# EAGLE design v2UvSterilisator (EAGLE 7.7.0)
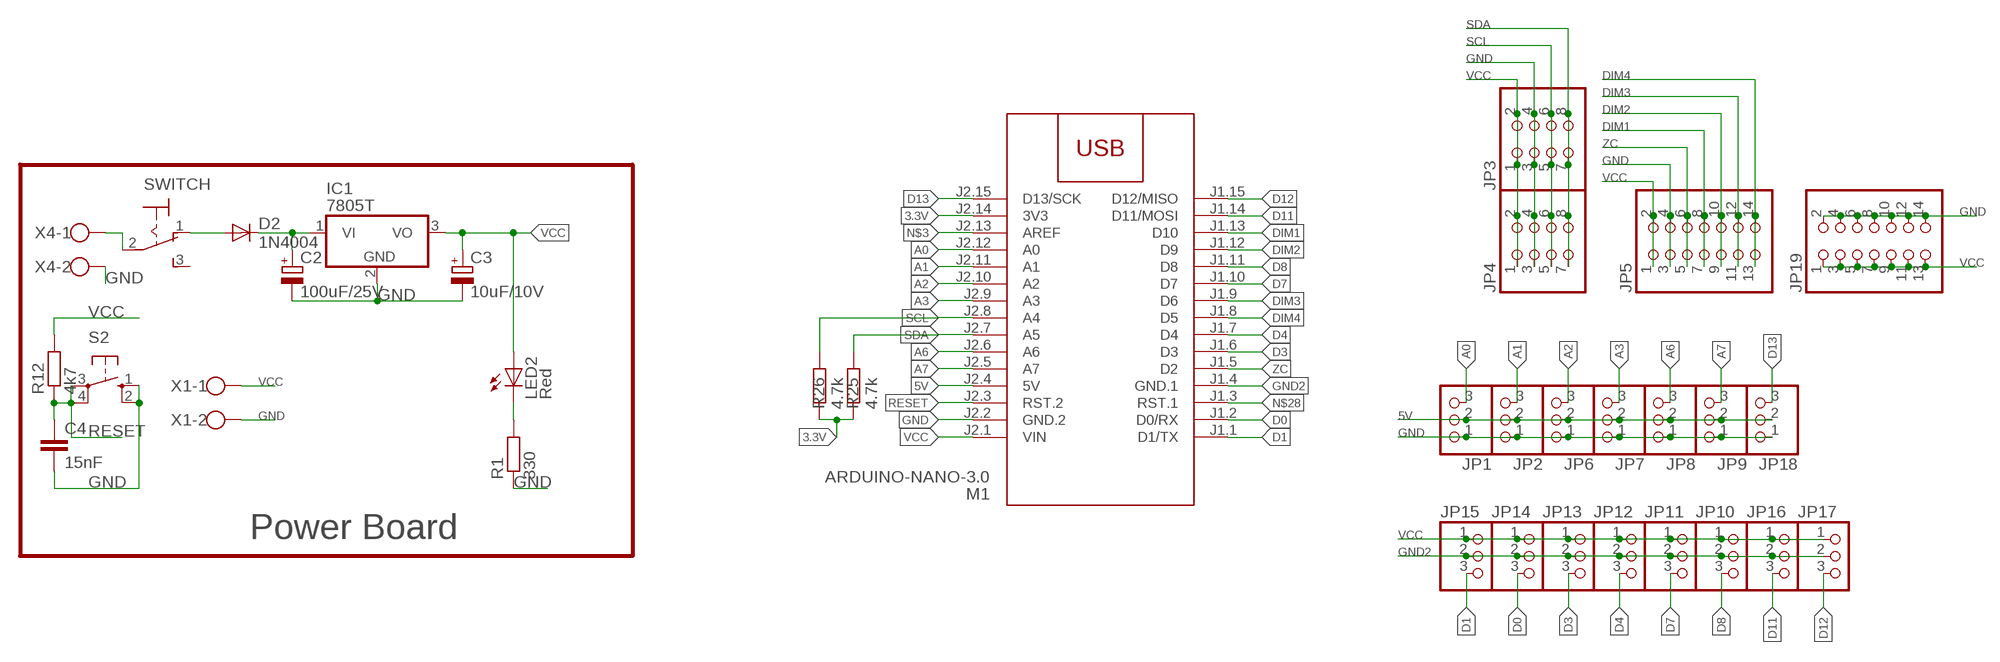
[diagram p0: schematic, sheet 1]

## Parts
C2  100uF/25V  CPOL-EUE5-8.5  [E5-8,5]
C3  10uF/10V  CPOL-EUE5-8.5  [E5-8,5]
C4  15nF  C-EUC0805  [C0805]
D2  1N4004  [DO41-10]
IC1  7805T  [TO220H]
JP1  PINHD-1X3  [1X03]
JP2  PINHD-1X3  [1X03]
JP3  PINHD-2X4  [2X04]
JP4  PINHD-2X4  [2X04]
JP5  PINHD-2X7  [2X07]
JP6  PINHD-1X3  [1X03]
JP7  PINHD-1X3  [1X03]
JP8  PINHD-1X3  [1X03]
JP9  PINHD-1X3  [1X03]
JP10  PINHD-1X3  [1X03]
JP11  PINHD-1X3  [1X03]
JP12  PINHD-1X3  [1X03]
JP13  PINHD-1X3  [1X03]
JP14  PINHD-1X3  [1X03]
JP15  PINHD-1X3  [1X03]
JP16  PINHD-1X3  [1X03]
JP17  PINHD-1X3  [1X03]
JP18  PINHD-1X3  [1X03]
JP19  PINHD-2X7  [2X07]
LED2  Red  LED3MM  [LED3MM]
M1  ARDUINO-NANO-3.0  [ARDUINO-NANO-3.0]
R1  330  R-EU_R1206  [R1206]
R12  4k7  R-EU_R1206  [R1206]
R25  4.7k  R-EU_R1206  [R1206]
R26  4.7k  R-EU_R1206  [R1206]
S2  10-XX  [B3F-10XX]
SWITCH  M9040P  [M9040P]
X1  W237-102  [W237-102]
X4  W237-102  [W237-102]

## Nets
3.3V: M1.J2.14(3V3) R25.2 R26.2
5V: JP1.2 JP2.2 JP6.2 JP7.2 JP8.2 JP9.2 JP18.2 M1.J2.4(5V)
12VSWITCH: D2.A SWITCH.1(O)
A0: JP1.3 M1.J2.12(A0)
A1: JP2.3 M1.J2.11(A1)
A2: JP6.3 M1.J2.10(A2)
A3: JP7.3 M1.J2.9(A3)
A6: JP8.3 M1.J2.6(A6)
A7: JP9.3 M1.J2.5(A7)
D0: JP14.3 M1.J1.2(D0/RX)
D1: JP15.3 M1.J1.1(D1/TX)
D3: JP13.3 M1.J1.6(D3)
D4: JP12.3 M1.J1.7(D4)
D7: JP11.3 M1.J1.10(D7)
D8: JP10.3 M1.J1.11(D8)
D11: JP16.3 M1.J1.14(D11/MOSI)
D12: JP17.3 M1.J1.15(D12/MISO)
D13: JP18.3 M1.J2.15(D13/SCK)
DIM1: JP5.7 JP5.8 M1.J1.13(D10)
DIM2: JP5.9 JP5.10 M1.J1.12(D9)
DIM3: JP5.11 JP5.12 M1.J1.9(D6)
DIM4: JP5.13 JP5.14 M1.J1.8(D5)
GND: C2.- C3.- C4.2 IC1.2(GND) JP1.1 JP2.1 JP3.3 JP3.4 JP4.3 JP4.4 JP5.3 JP5.4 JP6.1 JP7.1 JP8.1 JP9.1 JP18.1 JP19.2 JP19.4 JP19.6 JP19.8 JP19.10 JP19.12 JP19.14 M1.J2.2(GND.2) R1.1 S2.1(S) S2.2(S1) X1.2 X4.2
GND2: JP10.2 JP11.2 JP12.2 JP13.2 JP14.2 JP15.2 JP16.2 JP17.2 M1.J1.4(GND.1)
N$3: M1.J2.13(AREF)
N$28: M1.J1.3(RST.1)
N$37: C2.+ D2.C IC1.1(VI)
N$39: LED2.K(C) R1.2
N$40: SWITCH.2(P) X4.1
RESET: C4.1 M1.J2.3(RST.2) R12.1 S2.3(P) S2.4(P1)
SCL: JP3.5 JP3.6 JP4.5 JP4.6 M1.J2.8(A4) R26.1
SDA: JP3.7 JP3.8 JP4.7 JP4.8 M1.J2.7(A5) R25.1
VCC: C3.+ IC1.3(VO) JP3.1 JP3.2 JP4.1 JP4.2 JP5.1 JP5.2 JP10.1 JP11.1 JP12.1 JP13.1 JP14.1 JP15.1 JP16.1 JP17.1 JP19.1 JP19.3 JP19.5 JP19.7 JP19.9 JP19.11 JP19.13 LED2.A M1.J2.1(VIN) R12.2 X1.1
ZC: JP5.5 JP5.6 M1.J1.5(D2)
Unconnected: SWITCH.3(S)

## Notes on the sheet
- Power Board

## Library data of the parts
C2 C3 = rcl:CPOL-EU: POLARIZED CAPACITOR, European symbol
C4 = rcl:C-EU: CAPACITOR, European symbol
D2 = diode:1N4004: DIODE general purpose rectifier, 1 A
IC1 = linear:78*: Positive VOLTAGE REGULATOR Source: http://cache.national.com/ds/LM/LM78L05.pdf http://www.fairchildsemi.com/ds/LM/LM7805.pdf
JP1 JP2 JP6-JP18 = adafruit:PINHD-1X3: PIN HEADER
JP3 JP4 = adafruit:PINHD-2X4: PIN HEADER
JP5 JP19 = pinhead:PINHD-2X7: PIN HEADER
LED2 = led:LED: LED OSRAM: - CHIPLED LG R971, LG N971, LY N971, LG Q971, LY Q971, LO R971, LY R971 LH N974, LH R974 LS Q976, LO Q976, LY Q976 LO Q996 - Hyper CHIPLED LW Q18S LB Q993, LB Q99A, LB R99A - SideLED LS A670, LO A670, LY A670, LG A670, LP A670 LB A673, LV A673, LT A673, LW A673 LH A674 LY A675 LS A676, LA A676, LO A676, LY A676, LW A676 LS A679, LY A679, LG A679 - Hyper Micro SIDELED® LS Y876, LA Y876, LO Y876, LY Y876 LT Y87S - SmartLED LW L88C, LW L88S LB L89C, LB L89S, LG L890 LS L89K, LO L89K, LY L89K LS L896, LA L896, LO L896, LY L896 - TOPLED LS T670, LO T670, LY T670, LG T670, LP T670 LSG T670, LSP T670, LSY T670, LOP T670, LYG T670 LG T671, LOG T671, LSG T671 LB T673, LV T673, LT T673, LW T673 LH T674 LS T676, LA T676, LO T676, LY T676, LB T676, LH T676, LSB T676, LW T676 LB T67C, LV T67C, LT T67C, LS T67K, LO T67K, LY T67K, LW E67C LS E67B, LA E67B, LO E67B, LY E67B, LB E67C, LV E67C, LT E67C LW T67C LS T679, LY T679, LG T679 LS T770, LO T770, LY T770, LG T770, LP T770 LB T773, LV T773, LT T773, LW T773 LH T774 LS E675, LA E675, LY E675, LS T675 LS T776, LA T776, LO T776, LY T776, LB T776 LHGB T686 LT T68C, LB T68C - Hyper Mini TOPLED® LB M676 - Mini TOPLED Santana® LG M470 LS M47K, LO M47K, LY M47K Source: http://www.osram.convergy.de LUXEON: - LUMILED® LXK2-PW12-R00, LXK2-PW12-S00, LXK2-PW14-U00, LXK2-PW14-V00 LXK2-PM12-R00, LXK2-PM12-S00, LXK2-PM14-U00 LXK2-PE12-Q00, LXK2-PE12-R00, LXK2-PE12-S00, LXK2-PE14-T00, LXK2-PE14-U00 LXK2-PB12-K00, LXK2-PB12-L00, LXK2-PB12-M00, LXK2-PB14-N00, LXK2-PB14-P00, LXK2-PB14-Q00 LXK2-PR12-L00, LXK2-PR12-M00, LXK2-PR14-Q00, LXK2-PR14-R00 LXK2-PD12-Q00, LXK2-PD12-R00, LXK2-PD12-S00 LXK2-PH12-R00, LXK2-PH12-S00 LXK2-PL12-P00, LXK2-PL12-Q00, LXK2-PL12-R00 Source: www.luxeon.com KINGBRIGHT: KA-3528ASYC Source: www.kingbright.com
M1 = diy-modules:ARDUINO-NANO-3.0: Arduino Nano 3.0 and compatible devices More details available here: https://www.arduino.cc/en/Main/ArduinoBoardNano Click here to find device on ebay.com <http://www.ebay.com/sch/arduino+nano>
R1 R12 R25 R26 = rcl:R-EU_: RESISTOR, European symbol
S2 = switch-omron:10-XX: OMRON SWITCH; MPN: B3F-1000; OC_FARNELL: 176432; OC_NEWARK: 36M3542
SWITCH = switch:M9040P: TOGGLE SWITCH Marquardt
X1 X4 = wago102:W237-102: WAGO SCREW CLAMP; MPN: 237-102; OC_FARNELL: unknown; OC_NEWARK: 70K9898

## Board
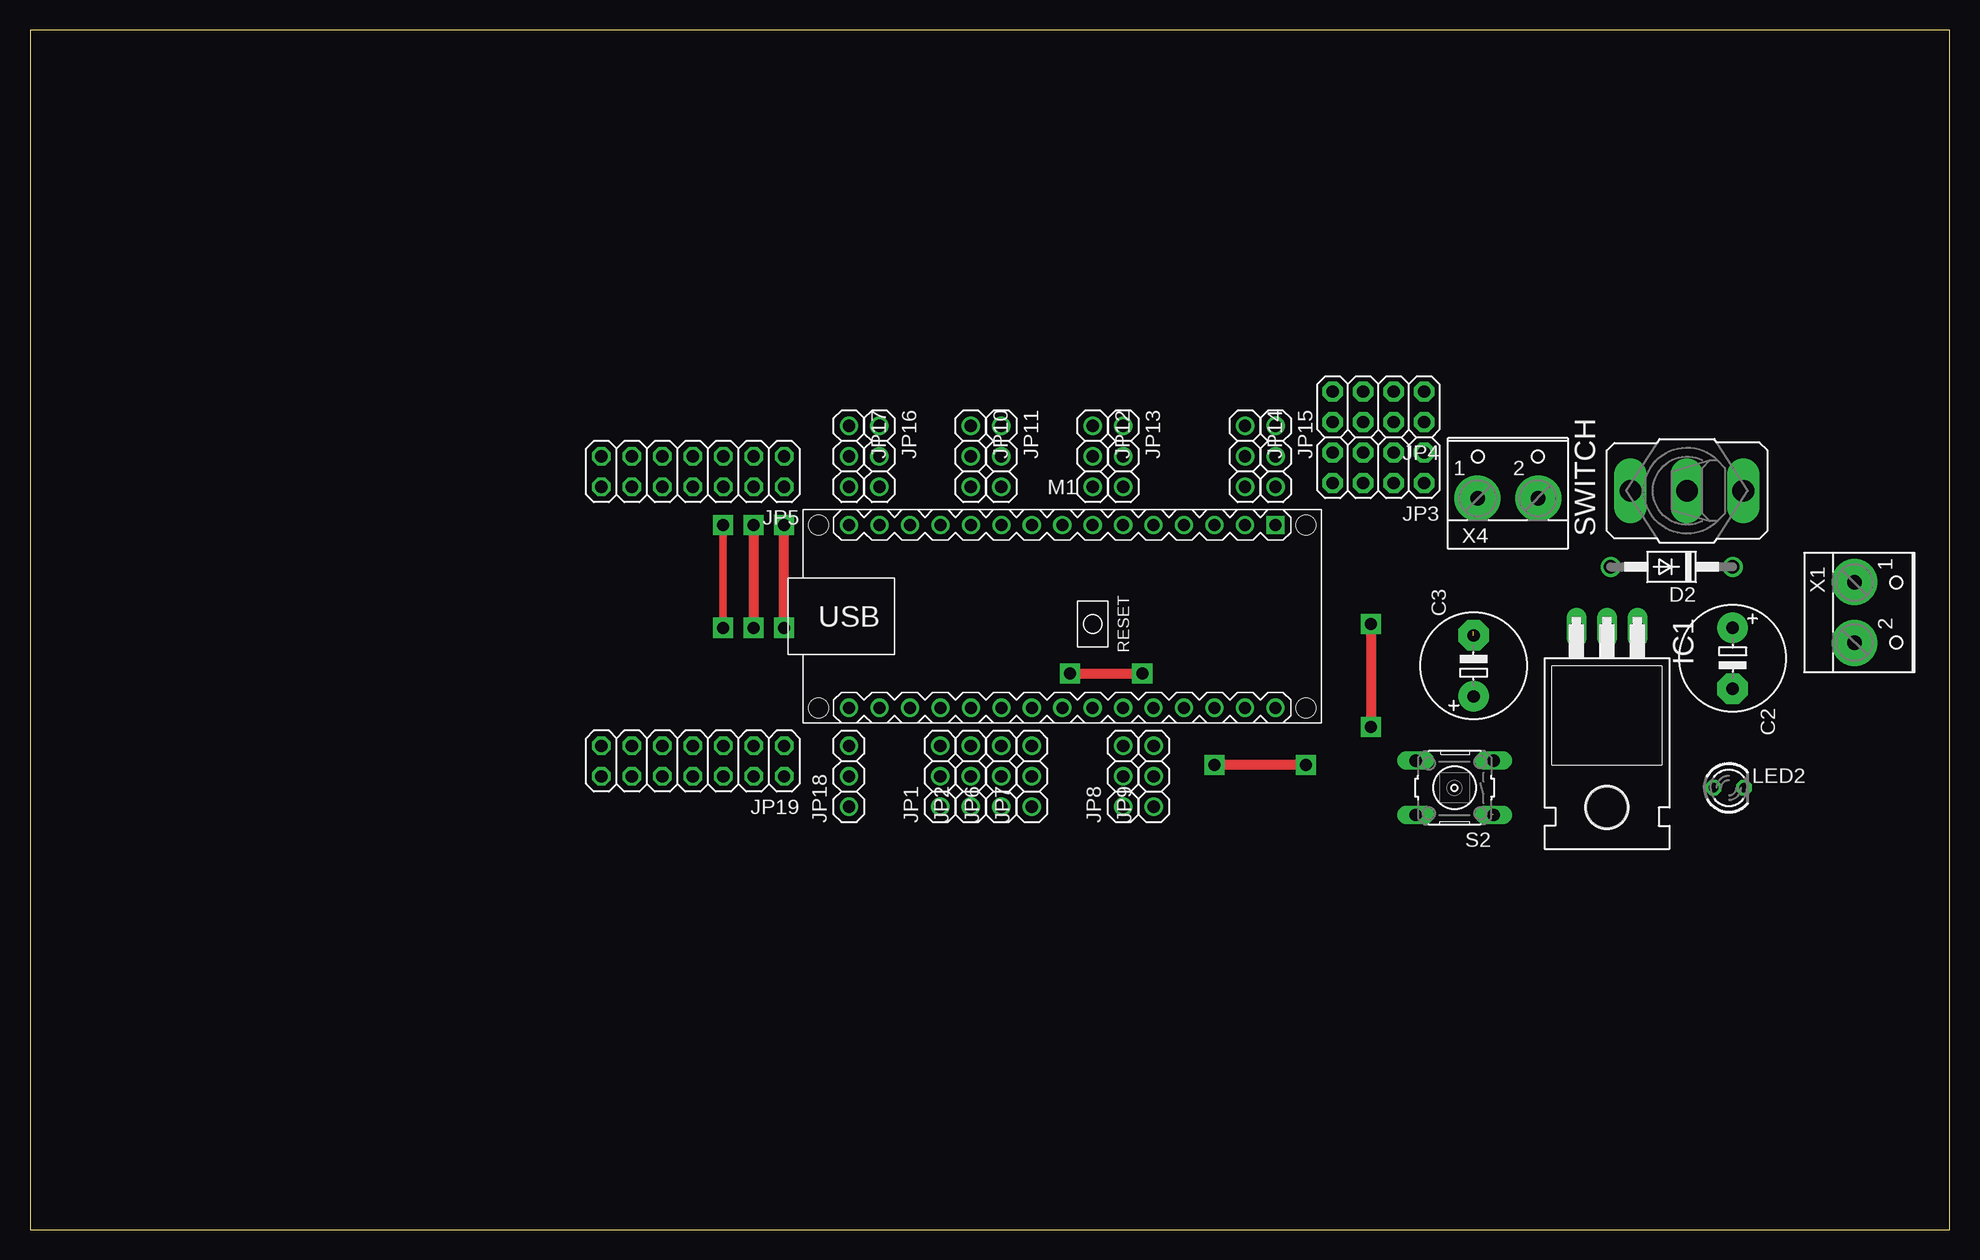
[diagram p1: board, top side]
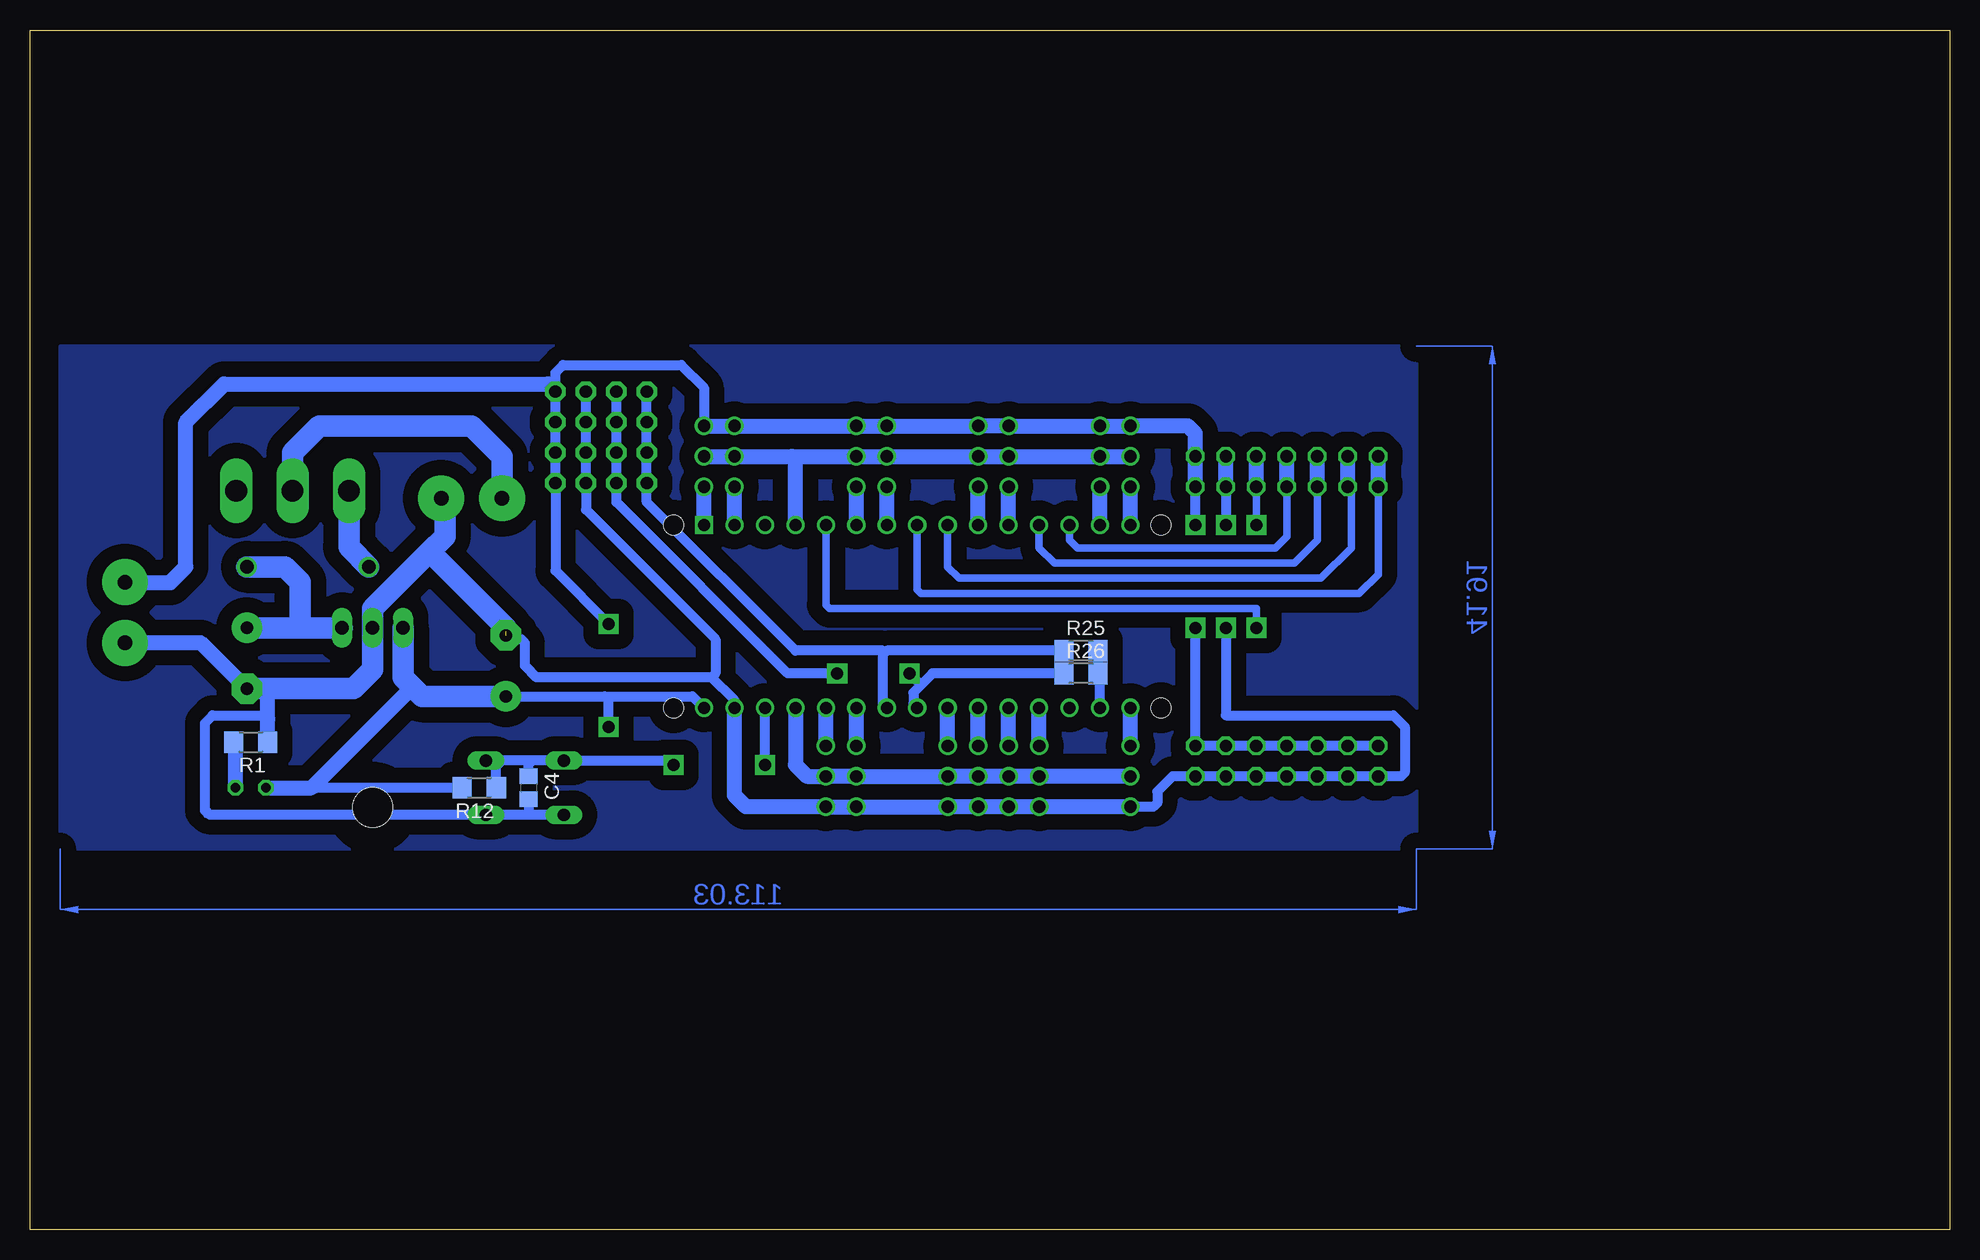
[diagram p2: board, bottom side, seen from below]

Size 160 x 100 mm. Coordinates in mm from the lower left corner, seen from the top.
Outline: 0,0 160,0 160,100 0,100 0,0
Copper layers (1*16): Top 0.035mm / dielectric 1.5mm / Bottom 0.035mm
Design rules "default": minimum track width 10mil, minimum drill 24mil, track to track 8mil, track to pad 8mil, pad to pad 8mil, via to via 8mil, smd to smd 8mil, copper to edge 40mil, drill to drill 8mil, minimum pad ring 10mil, minimum via ring 8mil, stop-mask expansion 4mil, vias tented up to drill 0mil, thermal gap 10mil

### Footprints (pad centres in the part's own frame; a part is rotated, then mirrored left to right if it is on the bottom)
E5-8,5 = drill 1.016 pad 2.54: + -2.54,0 | drill 1.016 pad 2.54 octagon: - 2.54,0
C0805 = smd 1.3 x 1.5: 1 -0.95,0; 2 0.95,0
DO41-10 = drill 1.118: A 5.08,0; C -5.08,0
TO220H = drill 1.118 long: 1 -2.54,-10.16; 2 0,-10.16; 3 2.54,-10.16 | hole 3.302: 0,4.826
1X03 = drill 1.016: 1 -2.54,0; 2 0,0; 3 2.54,0
2X04 = drill 1.016 pad 1.676 octagon: 1 -3.81,-1.27; 2 -3.81,1.27; 3 -1.27,-1.27; 4 -1.27,1.27; 5 1.27,-1.27; 6 1.27,1.27; 7 3.81,-1.27; 8 3.81,1.27
2X07 = drill 1.016 octagon: 1 -7.62,-1.27; 2 -7.62,1.27; 3 -5.08,-1.27; 4 -5.08,1.27; 5 -2.54,-1.27; 6 -2.54,1.27; 7 0,-1.27; 8 0,1.27; 9 2.54,-1.27; 10 2.54,1.27; 11 5.08,-1.27; 12 5.08,1.27; 13 7.62,-1.27; 14 7.62,1.27
LED3MM = drill 0.813 octagon: A -1.27,0; K 1.27,0
ARDUINO-NANO-3.0 = drill 1 square: J1.1 17.78,7.62 | drill 1: J1.2 15.24,7.62; J1.3 12.7,7.62; J1.4 10.16,7.62; J1.5 7.62,7.62; J1.6 5.08,7.62; J1.7 2.54,7.62; J1.8 0,7.62; J1.9 -2.54,7.62; J1.10 -5.08,7.62; J1.11 -7.62,7.62; J1.12 -10.16,7.62; J1.13 -12.7,7.62; J1.14 -15.24,7.62; J1.15 -17.78,7.62; J2.1 17.78,-7.62; J2.2 15.24,-7.62; J2.3 12.7,-7.62; J2.4 10.16,-7.62; J2.5 7.62,-7.62; J2.6 5.08,-7.62; J2.7 2.54,-7.62; J2.8 0,-7.62; J2.9 -2.54,-7.62; J2.10 -5.08,-7.62; J2.11 -7.62,-7.62; J2.12 -10.16,-7.62; J2.13 -12.7,-7.62; J2.14 -15.24,-7.62; J2.15 -17.78,-7.62 | hole 1.651: -20.32,7.62; -20.32,-7.62; 20.32,-7.62; 20.32,7.62
R1206 = smd 1.6 x 1.803: 1 -1.422,0; 2 1.422,0
B3F-10XX = drill 1.016 long: 1 -3.251,2.261; 2 3.251,2.261; 3 -3.251,-2.261; 4 3.251,-2.261
M9040P = drill 1.803 long: 1 0,4.699; 2 0,0; 3 0,-4.699
W237-102 = drill 1.194 long: 1 -2.5,-1.27; 2 2.5,-1.27 | drill 1.2 pad 3.81: 3 -2.54,-1.27; 4 2.54,-1.27

### Placement (x,y rotation side)
C2  141.92,47.62 270 top
C3  120.33,46.99 90 top
C4  118.43,36.83 270 bottom
D2  136.84,55.24 180 top
IC1  131.44,40.01 180 top
JP1  75.88,37.78 90 top
JP2  78.42,37.78 90 top
JP3  112.39,63.5 180 top
JP4  112.39,68.58 180 top
JP5  55.24,63.18 180 top
JP6  80.96,37.78 90 top
JP7  83.5,37.78 90 top
JP8  91.12,37.78 90 top
JP9  93.66,37.78 90 top
JP10  78.42,64.45 270 top
JP11  80.96,64.45 270 top
JP12  88.58,64.45 270 top
JP13  91.12,64.45 270 top
JP14  101.28,64.45 270 top
JP15  103.82,64.45 270 top
JP16  70.8,64.45 270 top
JP17  68.26,64.45 270 top
JP18  68.26,37.78 90 top
JP19  55.24,39.05 180 top
LED2  141.6,36.83 0 top
M1  86.04,51.12 0 top
R1  141.6,40.64 180 bottom
R12  122.56,36.83 180 bottom
R25  72.39,48.26 0 bottom
R26  72.39,46.35 0 bottom
S2  118.75,36.83 180 top
SWITCH  138.11,61.59 90 top
X1  153.35,51.44 270 top
X4  123.19,62.23 0 top

### Tracks (layer width: path | path; a pad name or v marks a point on that pad's centre or on a via)
3.3V
  Bottom 0.813: M1.J2.14 70.8,46.19 R26.2 R25.2
5V
  Bottom 1.27: M1.J2.4 96.2,38.73 95.25,37.78 JP9.2 JP8.2 JP7.2 JP6.2 JP2.2 76.52,37.78 JP1.2 JP18.2
12VSWITCH
  Bottom 1.778: SWITCH.1 133.41,56.9 D2.A
A0
  Bottom 1.27: JP1.3 M1.J2.12
A1
  Bottom 1.27: JP2.3 M1.J2.11
A2
  Bottom 1.27: JP6.3 M1.J2.10
A3
  Bottom 1.27: JP7.3 M1.J2.9
A6
  Bottom 1.27: JP8.3 M1.J2.6
A7
  Bottom 1.27: JP9.3 M1.J2.5
D0
  Bottom 1.27: M1.J1.2 JP14.3
D1
  Bottom 1.27: M1.J1.1 JP15.3
D3
  Bottom 1.27: M1.J1.6 JP13.3
D4
  Bottom 1.27: M1.J1.7 JP12.3
D7
  Bottom 1.27: M1.J1.10 JP11.3
D8
  Bottom 1.27: M1.J1.11 JP10.3
D11
  Bottom 1.27: M1.J1.14 JP16.3
D12
  Bottom 1.27: M1.J1.15 JP17.3
D13
  Bottom 1.27: JP18.3 M1.J2.15
DIM1
  Bottom 0.61: M1.J1.13 73.34,57.47 72.71,56.83 56.2,56.83 55.24,57.78 JP5.8
  Bottom 1.27: JP5.8 JP5.7
DIM2
  Bottom 0.61: M1.J1.12 75.88,56.83 74.61,55.56 54.61,55.56 52.7,57.47 JP5.10
  Bottom 1.27: JP5.10 JP5.9
DIM3
  Bottom 0.61: M1.J1.9 83.5,55.24 82.55,54.29 52.39,54.29 49.85,56.83 49.85,61.59 JP5.12
  Bottom 1.27: JP5.12 JP5.11
DIM4
  Bottom 0.61: M1.J1.8 86.04,53.34 85.72,53.02 49.21,53.02 47.62,54.61 JP5.14
  Bottom 1.27: JP5.14 JP5.13
GND  (via drill 1 pad 1.68)  (2 unrouted)
  Top 0.813: v60.33,58.74 v60.33,50.16
  Bottom 0.813: S2.2 118.43,34.57 | 118.43,34.57 S2.1 | C4.2 118.43,34.57 | M1.J2.2 101.28,44.13 103.19,46.04 | 103.19,46.04 117.79,46.04 118.75,46.99 118.75,48.9 119.06,49.21 120.02,49.21 C3.- | 140.18,42.55 140.5,42.86 144.78,42.86 145.41,42.23 145.41,34.92 145.1,34.61 121.92,34.61 | JP4.3 JP4.4 JP3.3 JP3.4 113.67,60.01 102.87,49.21 102.87,46.35 103.19,46.04 | JP5.4 v60.33,58.74 | v60.33,50.16 60.33,42.86 46.35,42.86 45.4,41.91 45.4,38.1 45.72,37.78 JP19.14 JP19.12 JP19.10 JP19.8 JP19.6 JP19.4 JP19.2 64.77,37.78 66.04,36.51 66.04,35.56 66.36,35.24 JP18.1
  Bottom 1.27: R1.1 140.18,42.55 140.18,44.92 140.02,45.09 | M1.J2.2 101.28,36.2 100.33,35.24 JP9.1 JP8.1 JP7.1 JP6.1 JP2.1 JP1.1 JP18.1 | JP5.4 JP5.3 | X1.2 145.77,48.94 C2.-
  Bottom 1.778: C3.- 120.65,49.53 | C2.- 140.02,45.09 133.03,45.09 131.44,46.67 IC1.2 131.44,51.75 126.68,56.52 | 126.68,56.52 125.41,57.78 125.41,60.68 X4.2 | 120.33,49.85 120.33,50.16 126.68,56.52
GND2
  Bottom 1.27: JP15.2 JP14.2 96.52,64.45 | 96.52,64.45 JP13.2 JP12.2 JP11.2 JP10.2 JP16.2 JP17.2 | M1.J1.4 96.2,64.14 96.52,64.45
N$1
  pour Bottom (isolate 1.27): 44.45,31.75 157.48,31.75 157.48,73.66 44.45,73.66
N$37
  Bottom 1.778: C2.+ 137.48,50.16 | 137.48,50.16 IC1.1 | D2.C 138.75,55.24 137.48,53.98 137.48,50.16
N$39
  Bottom 1.27: LED2.K 142.88,40.49 R1.2
N$40
  Bottom 1.778: SWITCH.2 138.11,64.77 135.89,66.99 123.19,66.99 120.65,64.45 120.65,61 X4.1
RESET  (via drill 1 pad 1.68)
  Top 0.813: v106.36,38.73 v98.74,38.73
  Bottom 0.813: 118.11,39.09 S2.4 106.72,39.09 v106.36,38.73 106.44,38.81 | 118.11,39.09 120.65,39.09 | 120.65,39.09 S2.3 | C4.1 118.43,38.77 118.11,39.09 | R12.1 121.13,38.61 120.65,39.09 | v98.74,38.73 M1.J2.3
SCL  (via drill 1 pad 1.68)
  Top 0.813: v86.68,46.35 v92.71,46.35
  Bottom 0.813: R26.1 84.77,46.35 85.72,45.4 | M1.J2.8 86.36,43.81 86.36,44.77 85.72,45.4 | 85.72,45.4 v86.68,46.35 | v92.71,46.35 96.84,46.35 111.12,60.64 JP3.6 JP3.5 JP4.6 JP4.5
SDA
  Bottom 0.813: R25.1 88.58,48.26 88.9,47.94 | M1.J2.7 88.9,43.81 88.9,47.94 | JP4.7 JP4.8 JP3.7 JP3.8 108.58,60.64 96.2,48.26 88.9,48.26 88.9,47.94
VCC  (via drill 1 pad 1.68)
  Top 0.813: v111.76,50.48 v111.76,41.91 | v62.87,50.16 v62.87,58.74
  Bottom 0.813: C3.+ 112.08,44.45 | 112.08,44.45 104.78,44.45 M1.J2.1 | v111.76,50.48 116.2,54.93 JP3.2 JP3.1 JP4.2 JP4.1 116.2,71.44 115.57,72.07 105.73,72.07 103.82,70.17 JP15.1 | v111.76,41.91 111.76,44.13 112.08,44.45 | v62.87,50.16 JP19.1 JP19.3 JP19.5 JP19.7 JP19.9 JP19.11 JP19.13 | v62.87,58.74 JP5.2 | R12.2 135.89,36.83 136.21,37.15
  Bottom 1.27: LED2.A 136.53,36.83 136.21,37.15 128.11,45.24 | JP5.2 JP5.1 62.87,66.36 63.5,66.99 JP17.1 JP16.1 JP10.1 JP11.1 JP12.1 JP13.1 JP14.1 JP15.1 | X1.1 148.31,53.94 147,55.24 147,67.31 143.83,70.48 116.84,70.48 JP4.1
  Bottom 1.778: IC1.3 128.91,46.04 128.11,45.24 127.32,44.45 C3.+
ZC  (via drill 1 pad 1.68)
  Top 0.61: v57.78,50.16 v57.78,58.74
  Bottom 0.61: M1.J1.5 93.66,52.07 93.34,51.75 57.78,51.75 v57.78,50.16 | v57.78,58.74 JP5.6
  Bottom 1.27: JP5.6 JP5.5
(copper drawn outside any net)
  shapes: Bottom area x2